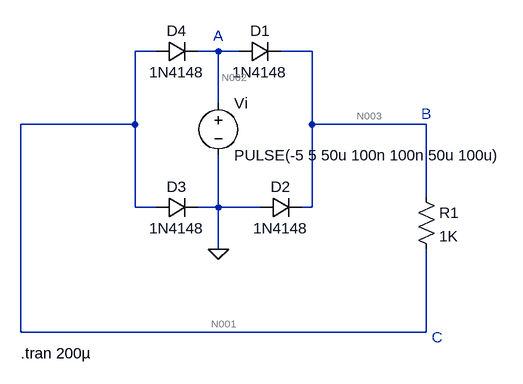
[diagram p0: schematic 1.2.2.asc]
1.2.2.asc, the LTspice schematic file:
Version 4
SHEET 1 880 680
WIRE 80 48 48 48
WIRE 176 48 144 48
WIRE 208 48 176 48
WIRE 320 48 272 48
WIRE 176 128 176 48
WIRE 48 160 48 48
WIRE 48 160 -128 160
WIRE 320 160 320 48
WIRE 496 160 320 160
WIRE 496 272 496 160
WIRE 48 288 48 160
WIRE 80 288 48 288
WIRE 176 288 176 208
WIRE 176 288 144 288
WIRE 240 288 176 288
WIRE 320 288 320 160
WIRE 320 288 304 288
WIRE 176 352 176 288
WIRE -128 480 -128 160
WIRE 496 480 496 352
WIRE 496 480 -128 480
FLAG 176 352 0
SYMBOL diode 208 64 R270
WINDOW 0 32 32 VTop 2
WINDOW 3 0 32 VBottom 2
SYMATTR InstName D1
SYMATTR Value 1N4148
SYMBOL diode 240 304 R270
WINDOW 0 32 32 VTop 2
WINDOW 3 0 32 VBottom 2
SYMATTR InstName D2
SYMATTR Value 1N4148
SYMBOL voltage 176 112 R0
WINDOW 123 24 124 Left 2
WINDOW 39 0 0 Left 0
SYMATTR InstName Vi
SYMATTR Value PULSE(-5 5 50u 100n 100n 50u 100u)
SYMBOL diode 80 32 M90
WINDOW 0 0 32 VBottom 2
WINDOW 3 32 32 VTop 2
SYMATTR InstName D4
SYMATTR Value 1N4148
SYMBOL diode 80 304 R270
WINDOW 0 32 32 VTop 2
WINDOW 3 0 32 VBottom 2
SYMATTR InstName D3
SYMATTR Value 1N4148
SYMBOL res 480 256 R0
SYMATTR InstName R1
SYMATTR Value 1K
TEXT 168 24 Left 2 ;A
TEXT 488 144 Left 2 ;B
TEXT 504 488 Left 2 ;C
TEXT -128 512 Left 2 !.tran 200µ

The netlist it stands for:
* 1.2.2.asc
D1 N002 N003 1N4148
D2 0 N003 1N4148
Vi N002 0 PULSE(-5 5 50u 100n 100n 50u 100u)
D4 N001 N002 1N4148
D3 N001 0 1N4148
R1 N003 N001 1K
.model D D
.lib standard.dio
* A
* B
* C
.tran 200µ
.backanno
.end

* Results of the author's LTspice run, read from the files saved beside the schematic
* Operating Point, zero values left out:
*   V(n002) = -5 V
*   V(n003) = -645.7 mV
*   V(n001) = -4.354 V
*   I(D3) = -2.524 nA
*   I(D4) = 3.709 mA
*   I(D2) = 3.709 mA
*   I(D1) = -2.524 nA
*   I(R1) = 3.709 mA
*   I(Vi) = 3.709 mA
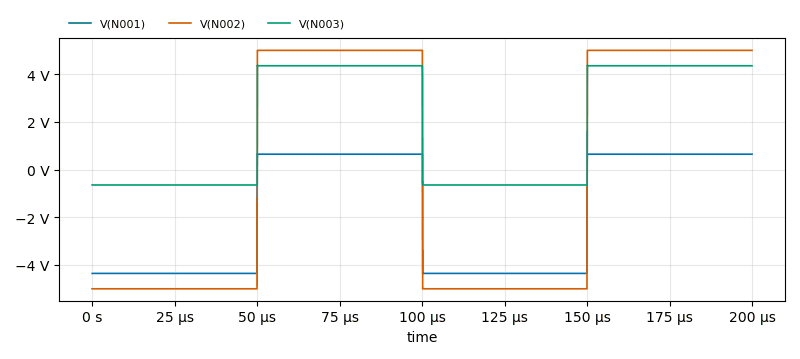
[diagram p1: Transient Analysis of 1.2.2.asc, plotted from the saved traces]
* Transient Analysis, 1 run:
*   V(N001): min -4.374 V, max 645.7 mV, average -1.851 V, rms 3.11 V, last 645.7 mV
*   V(N002): min -5 V, max 5 V, average 2.5 mV, rms 4.998 V, last 5 V
*   V(N003): min -645.7 mV, max 4.374 V, average 1.854 V, rms 3.112 V, last 4.354 V